# EAGLE design DMXmerger (EAGLE 9.0.0)
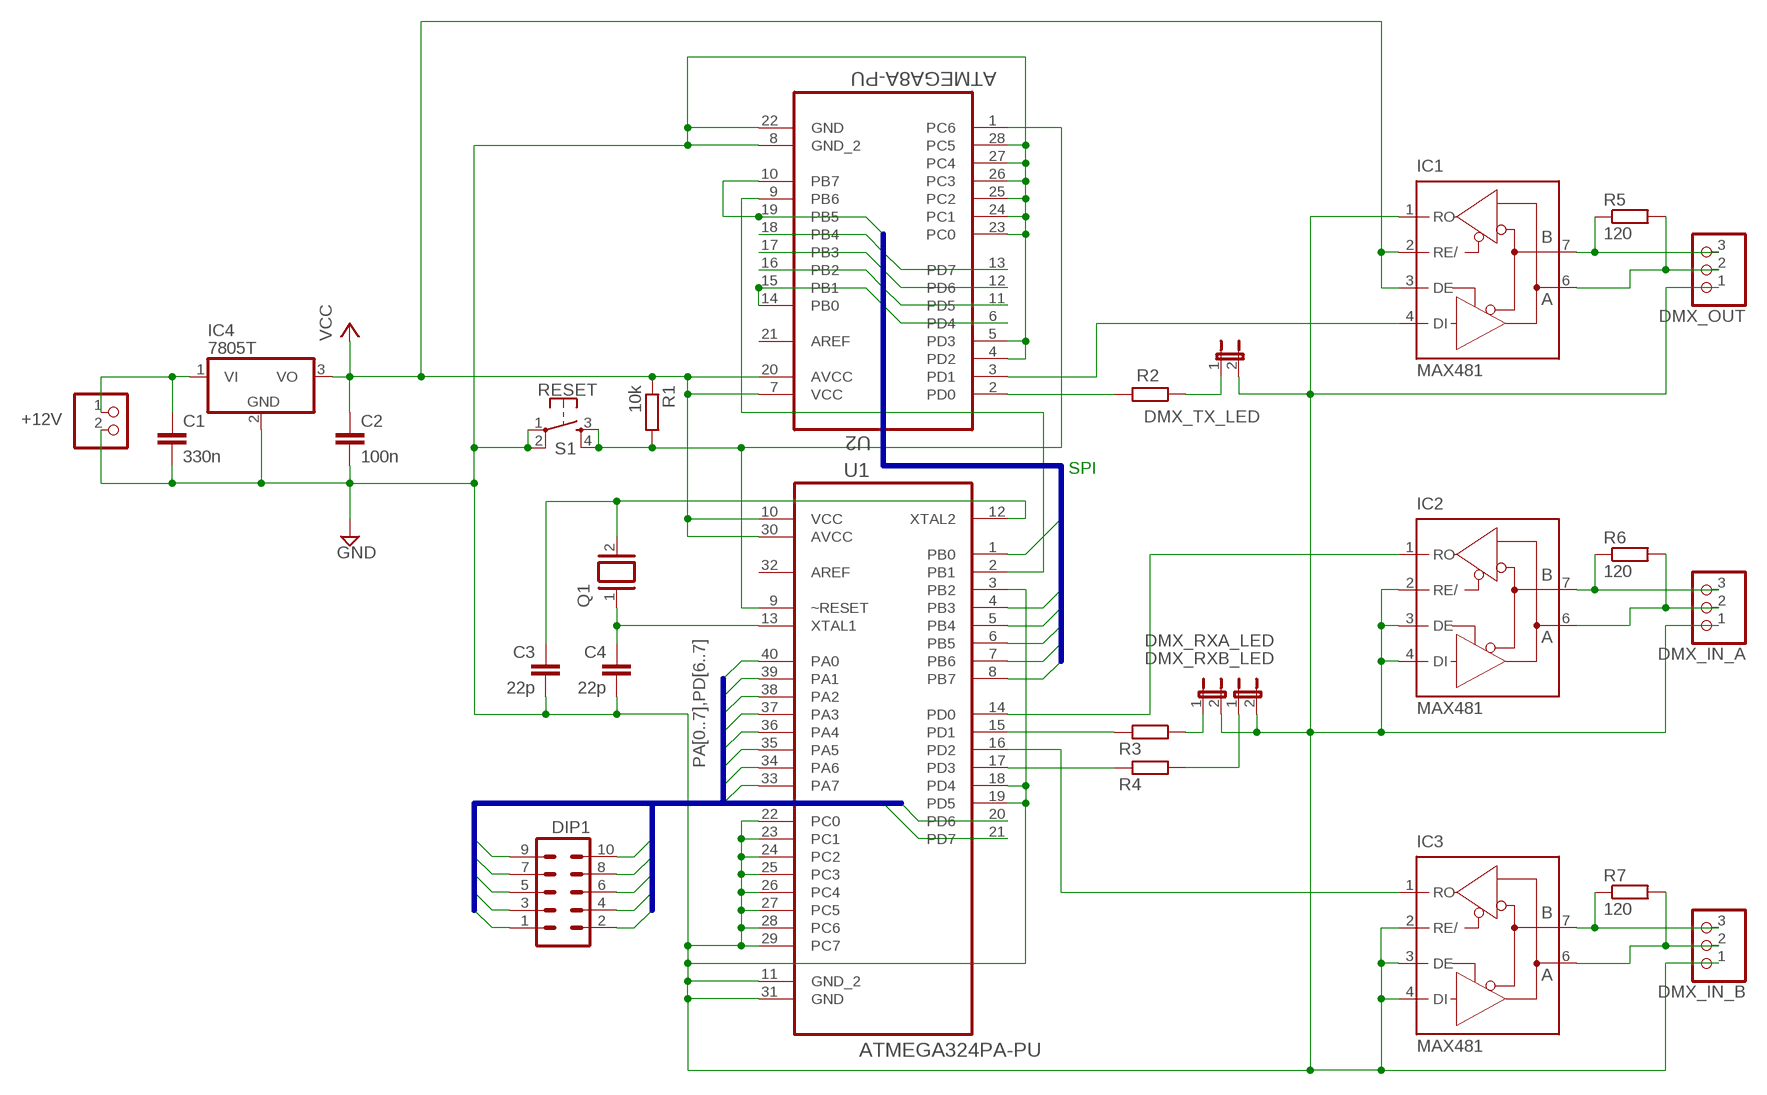
[diagram p0: schematic, sheet 1]

## Parts
+12V  PINHD-1X2  [1X02]
C1  330n  C5/3  [C5B3]
C2  100n  C5/3  [C5B3]
C3  22p  C5/3  [C5B3]
C4  22p  C5/3  [C5B3]
DIP1  MA05-2  [MA05-2]
DMX_IN_A  PINHD-1X3  [1X03]
DMX_IN_B  PINHD-1X3  [1X03]
DMX_OUT  PINHD-1X3  [1X03]
DMX_RXA_LED  JP1E  [JP1]
DMX_RXB_LED  JP1E  [JP1]
DMX_TX_LED  JP1E  [JP1]
IC1  MAX481  MAX481CPA  [DIL08]
IC2  MAX481  MAX481CPA  [DIL08]
IC3  MAX481  MAX481CPA  [DIL08]
IC4  7805T  [TO220H]
Q1  XTAL/S  [QS]
R1  10k  R-EU_0207/12  [0207/12]
R2  250  R-EU_0207/12  [0207/12]
R3  250  R-EU_0207/12  [0207/12]
R4  250  R-EU_0207/12  [0207/12]
R5  120  R-EU_0207/12  [0207/12]
R6  120  R-EU_0207/12  [0207/12]
R7  120  R-EU_0207/12  [0207/12]
S1  RESET  DTS-6  [DTS-6]
U1  ATMEGA324PA-PU  [DIP254P1524X482-40]
U2  ATMEGA8A-PU  [DIP254P762X457-28]

## Nets
1: DIP1.1 U1.37(PA3)
2: DIP1.2 U1.38(PA2)
3: DIP1.3 U1.36(PA4)
4: DIP1.4 U1.39(PA1)
5: DIP1.5 U1.35(PA5)
6: DIP1.6 U1.40(PA0)
7: DIP1.7 U1.34(PA6)
8: DIP1.8 U1.20(PD6)
9: DIP1.9 U1.33(PA7)
10: DIP1.10 U1.21(PD7)
GND: +12V.2 C1.2 C2.2 C3.2 C4.2 DMX_IN_A.1 DMX_IN_B.1 DMX_OUT.1 DMX_RXA_LED.2 DMX_RXB_LED.2 DMX_TX_LED.2 IC1.1(RO) IC2.2(RE/) IC2.3(DE) IC2.4(DI) IC3.2(RE/) IC3.3(DE) IC3.4(DI) IC4.2(GND) S1.1 S1.2 U1.3(PB2) U1.11(GND_2) U1.18(PD4) U1.19(PD5) U1.22(PC0) U1.23(PC1) U1.24(PC2) U1.25(PC3) U1.26(PC4) U1.27(PC5) U1.28(PC6) U1.29(PC7) U1.31(GND) U2.4(PD2) U2.5(PD3) U2.8(GND_2) U2.22(GND) U2.23(PC0) U2.24(PC1) U2.25(PC2) U2.26(PC3) U2.27(PC4) U2.28(PC5)
LED: U1.1(PB0) U2.6(PD4)
MISO: U1.7(PB6) U2.11(PD5) U2.18(PB4)
MOSI: U1.6(PB5) U2.12(PD6) U2.17(PB3)
N$1: DMX_TX_LED.1 R2.1
N$2: DMX_IN_B.3 IC3.7(B) R7.1
N$3: R2.2 U2.2(PD0)
N$4: U1.2(PB1) U2.9(PB6)
N$5: DMX_IN_B.2 IC3.6(A) R7.2
N$6: R1.2 S1.3 S1.4 U1.9(~RESET) U2.1(PC6)
N$9: C4.1 Q1.1 U1.13(XTAL1)
N$11: +12V.1 C1.1 IC4.1(VI)
N$14: DMX_OUT.3 IC1.7(B) R5.1
N$15: DMX_IN_A.3 IC2.7(B) R6.1
N$17: DMX_IN_A.2 IC2.6(A) R6.2
N$18: IC1.4(DI) U2.3(PD1)
N$21: DMX_OUT.2 IC1.6(A) R5.2
N$23: IC2.1(RO) U1.14(PD0)
N$25: IC3.1(RO) U1.16(PD2)
N$36: R3.2 U1.15(PD1)
N$37: R4.2 U1.17(PD3)
N$39: DMX_RXA_LED.1 R3.1
N$40: C3.1 Q1.2 U1.12(XTAL2)
N$44: DMX_RXB_LED.1 R4.1
RST: U1.4(PB3) U2.14(PB0) U2.15(PB1)
SCK: U1.8(PB7) U2.10(PB7) U2.19(PB5)
SS: U1.5(PB4) U2.13(PD7) U2.16(PB2)
VCC: C2.1 IC1.2(RE/) IC1.3(DE) IC4.3(VO) R1.1 U1.10(VCC) U1.30(AVCC) U2.7(VCC) U2.20(AVCC)
Unconnected: U1.32(AREF) U2.21(AREF)

## Buses
LED,MISO,MOSI,RST,SCK,SS
PA[0..7],PD[6..7]

## Notes on the sheet
- SPI

## Power pins joined to a net without a drawn wire
GND: IC1.5(GND) IC2.5(GND) IC3.5(GND)
VCC: IC1.8(VCC) IC2.8(VCC) IC3.8(VCC)

## Library data of the parts
+12V = pinhead:PINHD-1X2: PIN HEADER
C1-C4 = capacitor-wima:C: CAPACITOR naming: grid - package width
DIP1 = con-lstb:MA05-2: PIN HEADER; OC_FARNELL: unknown; OC_NEWARK: unknown
DMX_IN_A DMX_IN_B DMX_OUT = pinhead:PINHD-1X3: PIN HEADER
DMX_RXA_LED DMX_RXB_LED DMX_TX_LED = jumper:JP1E: JUMPER
IC1-IC3 = maxim:MAX481CPA: RS485 TRANSEIVER; MPN: MAX481CPA+; OC_FARNELL: unknown; OC_NEWARK: 99K3445
IC4 = linear:78*: Positive VOLTAGE REGULATOR Source: http://cache.national.com/ds/LM/LM78L05.pdf http://www.fairchildsemi.com/ds/LM/LM7805.pdf
Q1 = special:XTAL/S: CRYSTAL
R1-R7 = resistor:R-EU_: RESISTOR, European symbol
S1 = switch-tact:DTS-6
U1 = Atmel_By_element14_Batch_1-00:ATMEGA324PA-PU: 8-bit MCU; MPN: ATMEGA324PA-PU; OC_FARNELL: 1715485; OC_NEWARK: 15R0267; PACKAGE: DIP-40; SUPPLIER: ATMEL
U2 = Atmel_By_element14_Batch_1-00:ATMEGA8A-PU: 8-bit MCU; MPN: ATMEGA8A-PU; OC_FARNELL: 1748534; OC_NEWARK: 26R5640; PACKAGE: DIP-28; SUPPLIER: Atmel

## Board
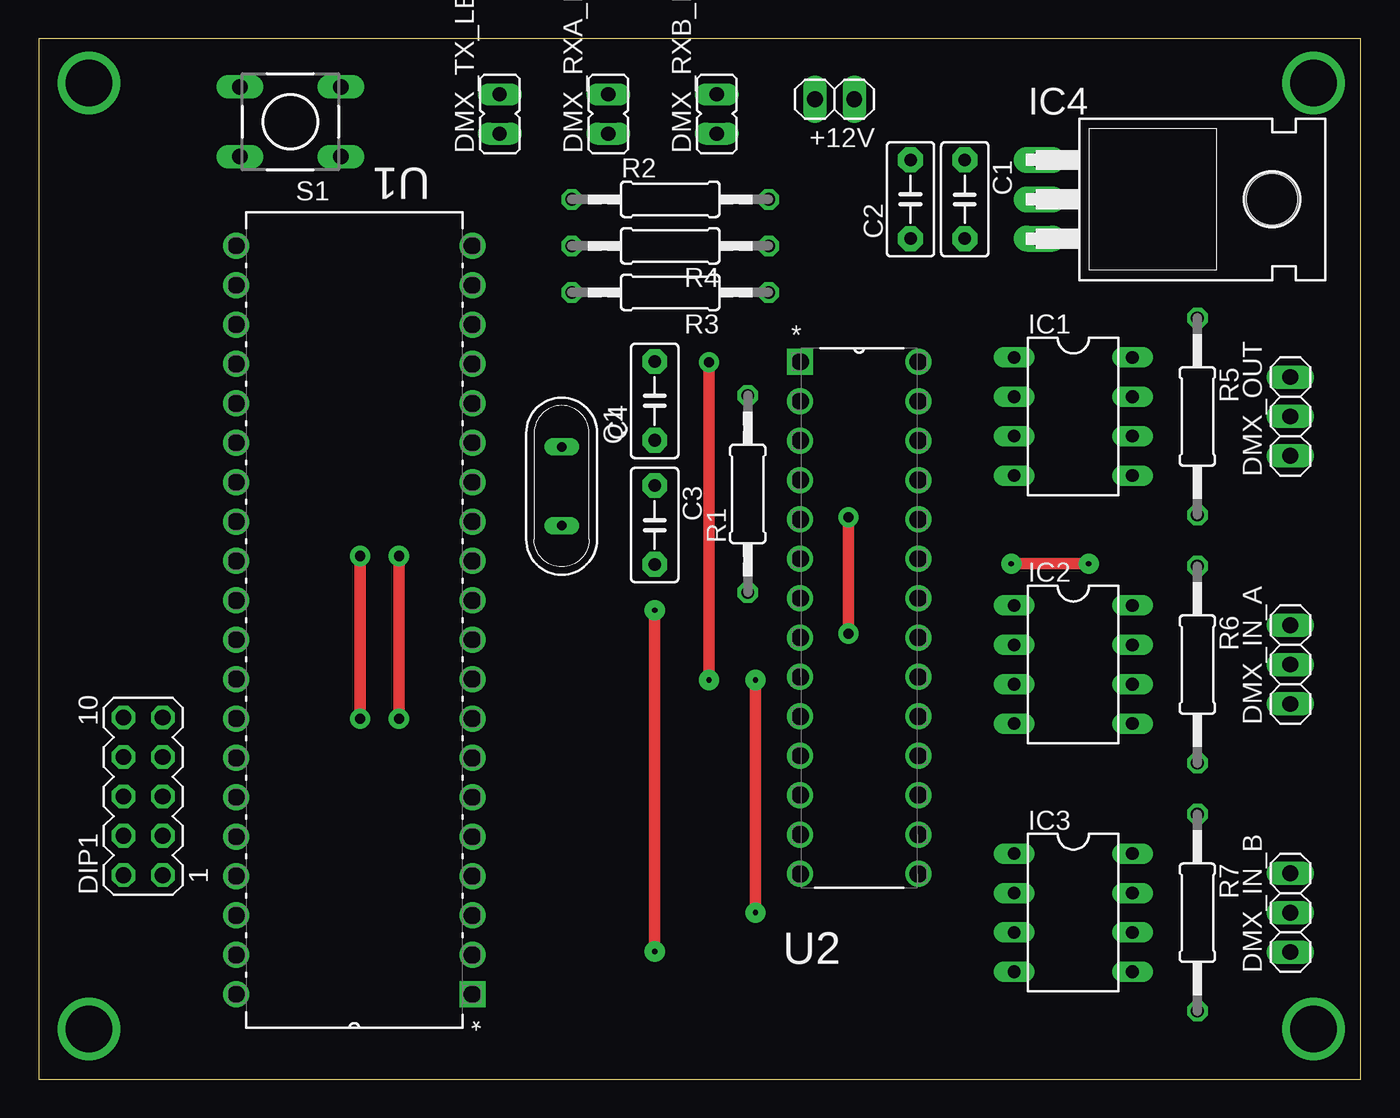
[diagram p1: board, top side]
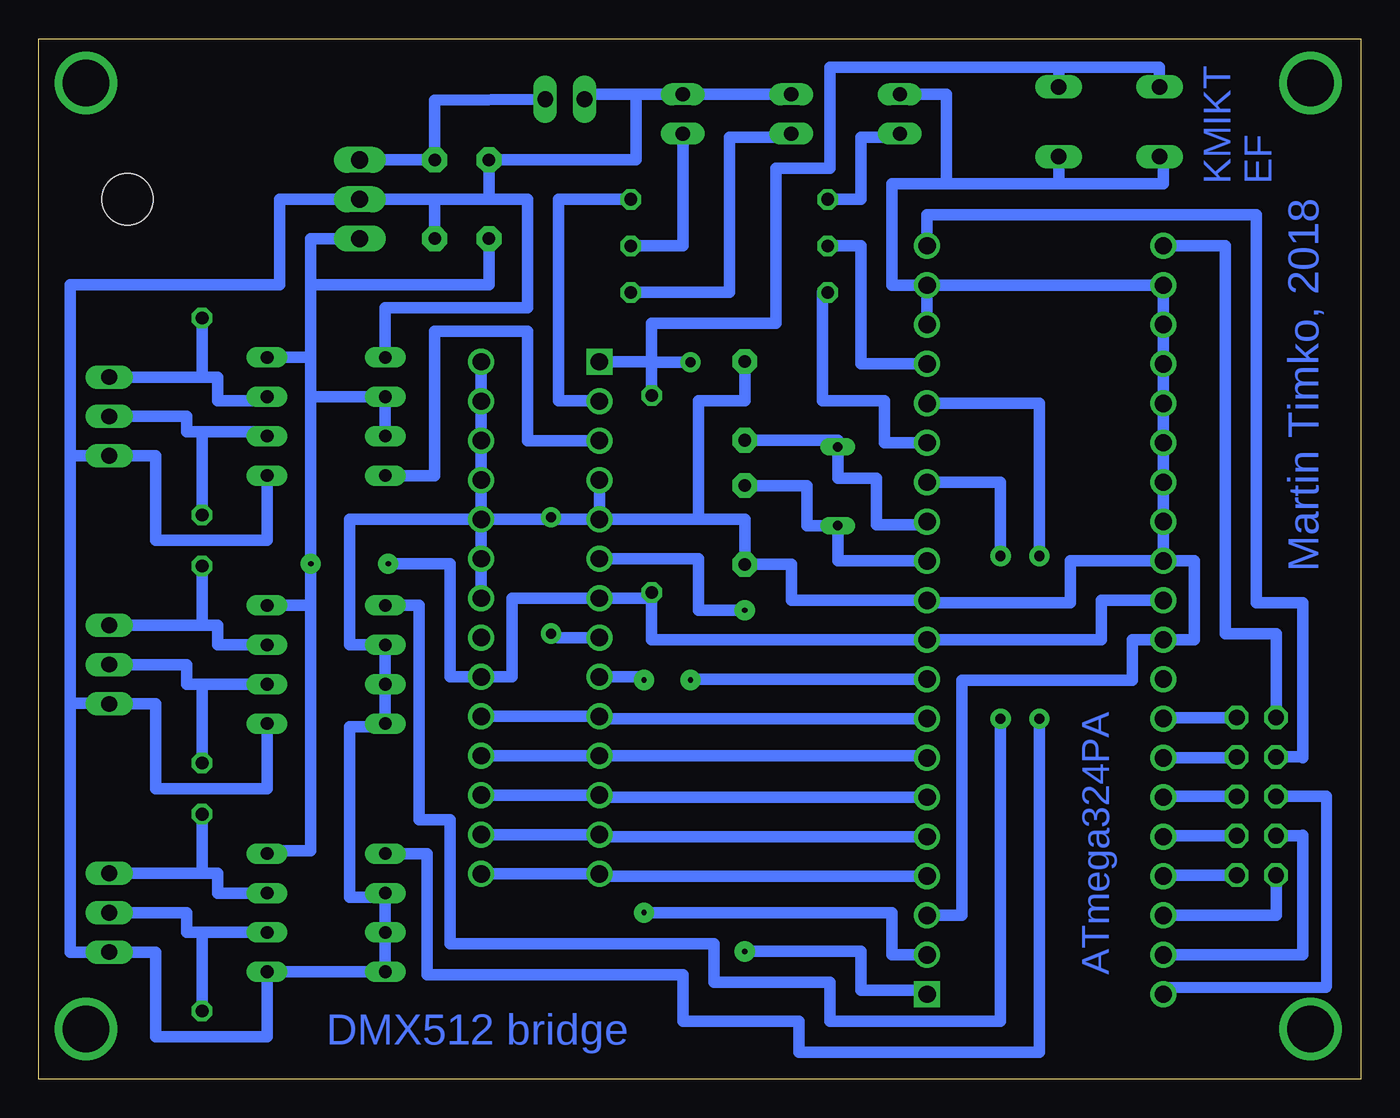
[diagram p2: board, bottom side, seen from below]

Size 85.27 x 67.08 mm. Coordinates in mm from the lower left corner, seen from the top.
Outline: 0,0 85.27,0 85.27,67.08 0,67.08 0,0
Copper layers (1*16): Top 0.035mm / dielectric 1.5mm / Bottom 0.035mm
Design rules "default": minimum track width 10mil, minimum drill 24mil, track to track 8mil, track to pad 8mil, pad to pad 8mil, via to via 8mil, smd to smd 8mil, copper to edge 40mil, drill to drill 8mil, minimum pad ring 10mil, minimum via ring 8mil, stop-mask expansion 4mil, vias tented up to drill 0mil, thermal gap 10mil

### Footprints (pad centres in the part's own frame; a part is rotated, then mirrored left to right if it is on the bottom)
1X02 = drill 1.016 long: 1 -1.27,0; 2 1.27,0
C5B3 = drill 0.813 pad 1.6 octagon: 1 -2.54,0; 2 2.54,0
MA05-2 = drill 1.016 octagon: 1 -5.08,-1.27; 2 -5.08,1.27; 3 -2.54,-1.27; 4 -2.54,1.27; 5 0,-1.27; 6 0,1.27; 7 2.54,-1.27; 8 2.54,1.27; 9 5.08,-1.27; 10 5.08,1.27
1X03 = drill 1.016 long: 1 -2.54,0; 2 0,0; 3 2.54,0
JP1 = drill 0.914 long: 1 0,-1.27; 2 0,1.27
DIL08 = drill 0.813 long: 1 -3.81,-3.81; 2 -1.27,-3.81; 3 1.27,-3.81; 4 3.81,-3.81; 5 3.81,3.81; 6 1.27,3.81; 7 -1.27,3.81; 8 -3.81,3.81
TO220H = drill 1.118 long: 1 -2.54,-10.16; 2 0,-10.16; 3 2.54,-10.16 | hole 3.302: 0,4.826
QS = drill 0.61 long: 1 -2.54,0; 2 2.54,0
0207/12 = drill 0.813 octagon: 1 -6.35,0; 2 6.35,0
DTS-6 = drill 1 long: 1 -3.25,2.25; 2 3.25,2.25; 3 -3.25,-2.25; 4 3.25,-2.25
DIP254P1524X482-40 = drill 1.118 square: 1 -15.24,48.26 | drill 1.118: 2 -15.24,45.72; 3 -15.24,43.18; 4 -15.24,40.64; 5 -15.24,38.1; 6 -15.24,35.56; 7 -15.24,33.02; 8 -15.24,30.48; 9 -15.24,27.94; 10 -15.24,25.4; 11 -15.24,22.86; 12 -15.24,20.32; 13 -15.24,17.78; 14 -15.24,15.24; 15 -15.24,12.7; 16 -15.24,10.16; 17 -15.24,7.62; 18 -15.24,5.08; 19 -15.24,2.54; 20 -15.24,0; 21 0,0; 22 0,2.54; 23 0,5.08; 24 0,7.62; 25 0,10.16; 26 0,12.7; 27 0,15.24; 28 0,17.78; 29 0,20.32; 30 0,22.86; 31 0,25.4; 32 0,27.94; 33 0,30.48; 34 0,33.02; 35 0,35.56; 36 0,38.1; 37 0,40.64; 38 0,43.18; 39 0,45.72; 40 0,48.26
DIP254P762X457-28 = drill 1.118 square: 1 -7.62,33.02 | drill 1.118: 2 -7.62,30.48; 3 -7.62,27.94; 4 -7.62,25.4; 5 -7.62,22.86; 6 -7.62,20.32; 7 -7.62,17.78; 8 -7.62,15.24; 9 -7.62,12.7; 10 -7.62,10.16; 11 -7.62,7.62; 12 -7.62,5.08; 13 -7.62,2.54; 14 -7.62,0; 15 0,0; 16 0,2.54; 17 0,5.08; 18 0,7.62; 19 0,10.16; 20 0,12.7; 21 0,15.24; 22 0,17.78; 23 0,20.32; 24 0,22.86; 25 0,25.4; 26 0,27.94; 27 0,30.48; 28 0,33.02

### Placement (x,y rotation side)
+12V  51.33,63.18 180 top
C1  59.73,56.73 270 top
C2  56.23,56.73 90 top
C3  39.73,35.73 270 top
C4  39.73,43.73 90 top
DIP1  6.73,18.23 90 top
DMX_IN_A  80.73,26.73 90 top
DMX_IN_B  80.73,10.73 90 top
DMX_OUT  80.73,42.73 90 top
DMX_RXA_LED  36.73,62.23 0 top
DMX_RXB_LED  43.73,62.23 0 top
DMX_TX_LED  29.73,62.23 0 top
IC1  66.73,42.73 270 top
IC2  66.73,26.73 270 top
IC3  66.73,10.73 270 top
IC4  74.73,56.73 270 top
Q1  33.73,38.23 270 top
R1  45.73,37.73 90 top
R2  40.73,56.73 0 top
R3  40.73,50.73 180 top
R4  40.73,53.73 180 top
R5  74.73,42.73 270 top
R6  74.73,26.73 270 top
R7  74.73,10.73 270 top
S1  16.23,61.73 180 top
U1  12.73,53.73 180 top
U2  56.73,13.23 0 top

### Tracks (layer width: path | path; a pad name or v marks a point on that pad's centre or on a via)
1
  Bottom 0.75: DIP1.1 12.73,13.15 U1.37
2
  Bottom 0.75: U1.38 5.46,10.55 DIP1.2
3
  Bottom 0.75: U1.36 12.73,15.69 DIP1.3
4
  Bottom 0.75: U1.39 3.73,8.01 3.73,15.69 | 3.73,15.73 3.73,15.69 | 3.73,15.69 DIP1.4
5
  Bottom 0.75: DIP1.5 12.73,18.23 U1.35
6
  Bottom 0.7: 2.23,18.23 2.23,5.89 12.73,5.89 U1.40
  Bottom 0.75: 2.23,18.23 DIP1.6
7
  Bottom 0.75: DIP1.7 8,20.71 U1.34
8
  Bottom 0.75: U1.20 27.97,55.73 6.73,55.73 6.73,30.73 3.73,30.73 3.73,20.77 | 3.73,20.73 3.73,20.77 | 3.73,20.77 DIP1.8
9
  Bottom 0.75: DIP1.9 12.73,23.31 U1.33
10
  Bottom 0.75: U1.21 8.73,53.73 8.73,28.73 5.46,28.73 DIP1.10
GND  (via drill 0.65 pad 1.3)
  Top 0.75: v52.23,36.23 v52.23,28.73
  Bottom 0.75: U1.29 18.73,33.41 18.73,30.73 27.97,30.73 U1.11 36.73,30.87 36.73,33.19 C3.2 39.73,36.09 42.73,36.09 | U1.19 U1.22 U1.23 U1.24 U1.25 U1.26 U1.27 U1.28 U1.29 | IC1.5 70.54,34.73 77.73,34.73 77.73,40.19 DMX_OUT.1 83.23,40.19 | IC2.5 70.54,18.73 77.73,18.73 77.73,24.19 DMX_IN_A.1 80.73,24.23 83.23,24.23 | IC3.4 62.92,6.73 | 83.23,40.19 83.23,51.23 69.73,51.23 69.73,56.73 IC4.2 59.73,56.73 | 83.23,40.19 83.23,24.23 | 83.23,24.23 83.23,8.19 DMX_IN_B.1 77.73,8.19 77.73,2.73 70.54,2.73 IC3.5 IC3.4 | C1.2 59.73,56.73 | 59.73,56.73 56.23,56.73 | 56.23,56.73 C2.2 46.73,59.27 46.73,63.5 | U2.24 U2.25 U2.26 U2.27 U2.28 | IC1.1 62.92,49.73 53.73,49.73 53.73,56.73 56.23,56.73 | U2.24 65.23,36.09 65.23,28 IC2.2 IC2.3 IC2.4 62.92,22.73 65.23,22.73 65.23,11.73 62.92,11.73 IC3.2 IC3.3 IC3.4 | U1.19 U1.18 | U1.29 10.73,33.41 10.73,28.33 U1.31 14.73,28.33 14.73,25.73 25.73,25.73 25.73,10.55 U1.3 | U1.19 30.23,51.19 30.23,57.73 26.73,57.73 | DMX_TX_LED.2 26.73,63.5 26.73,57.73 | 46.73,63.5 50.06,63.5 +12V.2 | DMX_RXA_LED.2 DMX_RXB_LED.2 46.73,63.5 | U2.24 U2.23 U2.22 | U2.4 U2.5 | U2.24 51.73,36.09 | 51.73,36.09 U2.5 | U2.5 42.73,36.09 | U2.8 51.73,28.47 v52.23,28.73 | 51.73,36.09 v52.23,36.23 | 26.73,57.73 19.48,57.73 | 19.48,57.73 S1.1 | 19.48,57.73 12.73,57.73 12.73,59.48 S1.2 | C4.2 39.73,43.73 42.73,43.73 42.73,36.09
LED  (via drill 0.35 pad 1.3)
  Top 0.75: v39.73,30.23 v39.73,8.23
  Bottom 0.75: U2.6 42.73,33.55 42.73,30.23 v39.73,30.23 | U1.1 27.97,5.73 32.23,5.73 32.23,8.23 v39.73,8.23
MISO
  Bottom 0.75: U1.7 27.97,20.85 U2.11 U2.18
MOSI
  Bottom 0.75: 27.97,18.31 U1.6 49.11,18.17 U2.12 U2.17
N$1
  Bottom 0.75: DMX_TX_LED.1 29.73,60.73 32.23,60.73 32.23,56.73 R2.1
N$2
  Bottom 0.75: IC3.7 73.73,12 73.73,13.27 74.73,13.27 | 74.73,13.27 DMX_IN_B.3 | R7.1 74.73,13.27
N$3
  Bottom 0.75: U2.2 49.11,43.73 51.73,43.73 51.73,56.73 R2.2
N$4  (via drill 0.35 pad 1.3)
  Top 0.75: v46.23,25.73 v46.23,10.73
  Bottom 0.75: U2.9 46.23,25.93 v46.23,25.73 | U1.2 30.23,8.01 30.23,10.73 v46.23,10.73
N$5
  Bottom 0.75: DMX_IN_B.2 75.73,10.73 75.73,9.46 74.73,9.46 | 74.73,9.46 IC3.6 | R7.2 74.73,9.46
N$6  (via drill 0.35 pad 1.3, 0.65 pad 1.3)
  Top 0.75: v43.23,25.73 v43.23,46.23
  Bottom 0.75: 27.97,25.73 U1.9 43.23,25.79 v43.23,25.73 | U2.1 45.73,46.25 | 45.73,46.23 R1.2 45.73,44.23 | 45.73,46.25 45.73,48.73 37.73,48.73 37.73,58.73 34.23,58.73 34.23,65.23 19.48,65.23 | 19.48,65.23 S1.3 | 19.48,65.23 12.98,65.23 S1.4 | v43.23,46.23 45.73,46.23 | 45.73,46.23 45.73,46.25
N$7  (via drill 3)
  other vias: 82.23,64.23
N$8  (via drill 3)
  other vias: 82.23,3.23
N$9
  Bottom 0.75: 27.97,35.77 U1.13 27.97,35.73 31.23,35.73 31.23,38.73 33.73,38.73 Q1.1 33.73,41.19 C4.1
N$10  (via drill 3)
  other vias: 3.23,3.23
N$11
  Bottom 0.75: IC4.1 C1.1 | C1.1 59.73,59.73 | +12V.1 59.73,63.1 C1.1
N$12  (via drill 3)
  other vias: 3.23,64.23
N$14
  Bottom 0.75: DMX_OUT.3 74.73,45.27 | 74.73,45.27 73.73,45.27 73.73,43.73 70.54,43.73 IC1.7 | R5.1 74.73,45.27
N$15
  Bottom 0.75: DMX_IN_A.3 74.73,29.27 | 74.73,29.27 73.73,29.27 73.73,28 IC2.7 | R6.1 74.73,29.27
N$17
  Bottom 0.75: IC2.6 74.73,25.46 | 74.73,25.46 75.73,25.46 75.73,26.73 DMX_IN_A.2 | R6.2 74.73,25.46
N$18
  Bottom 0.75: IC1.4 59.73,38.92 59.73,48.23 53.73,48.23 53.73,41.17 U2.3
N$21
  Bottom 0.75: IC1.6 70.54,41.73 74.73,41.73 | 74.73,41.73 75.73,41.73 75.73,42.73 DMX_OUT.2 | R5.2 74.73,41.73
N$23  (via drill 0.65 pad 1.3)
  Top 0.75: v23.23,33.73 v23.23,23.23
  Bottom 0.75: v23.23,23.23 23.23,3.73 34.23,3.73 34.23,6.23 41.73,6.23 41.73,8.73 58.73,8.73 58.73,16.73 60.73,16.73 60.73,30.54 IC2.1 | U1.14 23.23,38.49 v23.23,33.73
N$25  (via drill 0.65 pad 1.3)
  Top 0.75: v20.73,33.73 v20.73,23.23
  Bottom 0.75: v20.73,23.23 20.73,1.73 36.23,1.73 36.23,3.73 43.73,3.73 43.73,6.73 60.23,6.73 60.23,14.54 IC3.1 | U1.16 20.73,43.57 v20.73,33.73
N$36
  Bottom 0.75: U1.15 30.73,41.03 30.73,43.73 34.73,43.73 34.73,50.73 R3.2
N$37
  Bottom 0.75: R4.2 32.23,53.73 32.23,46.11 U1.17
N$39
  Bottom 0.75: DMX_RXA_LED.1 36.73,60.73 40.73,60.73 40.73,50.73 R3.1
N$40
  Bottom 0.75: U1.12 33.73,33.41 Q1.2 35.73,35.69 35.73,38.27 C3.1
N$44
  Bottom 0.75: DMX_RXB_LED.1 43.73,53.73 R4.1
RST
  Bottom 0.75: 27.97,13.23 U1.4 49.11,13.09 U2.14 U2.15
SCK
  Bottom 0.75: 27.97,23.39 U1.8 49.11,23.25 U2.10 U2.19
SS
  Bottom 0.75: 27.97,15.77 U1.5 49.11,15.63 U2.13 U2.16
VCC  (via drill 0.35 pad 1.3)
  Top 0.75: v62.73,33.23 v67.73,33.23
  Bottom 0.75: U1.30 16.73,30.87 16.73,28.33 U1.10 45.73,28.33 45.73,31.01 | IC1.3 IC1.2 67.73,44 | 67.73,51.23 67.73,46.54 | 67.73,46.54 67.73,44 | 67.73,44 v67.73,33.23 67.73,30.54 | 67.73,30.54 67.73,14.73 70.54,14.73 IC3.8 | IC2.8 67.73,30.54 | IC4.3 67.73,54.19 67.73,51.23 | C2.1 56.23,51.23 67.73,51.23 | IC1.8 67.73,46.54 | 45.73,31.01 R1.1 | 45.73,31.01 U2.7 54.73,31.01 54.73,25.93 U2.20 58.73,25.93 58.73,33.23 v62.73,33.23

### Text on the board
Bottom: KMIKT / EF | Martin Timko, 2018 | ATmega324PA | DMX512 bridge